# EAGLE design Binary Clock (no alarm) (EAGLE 5.06)
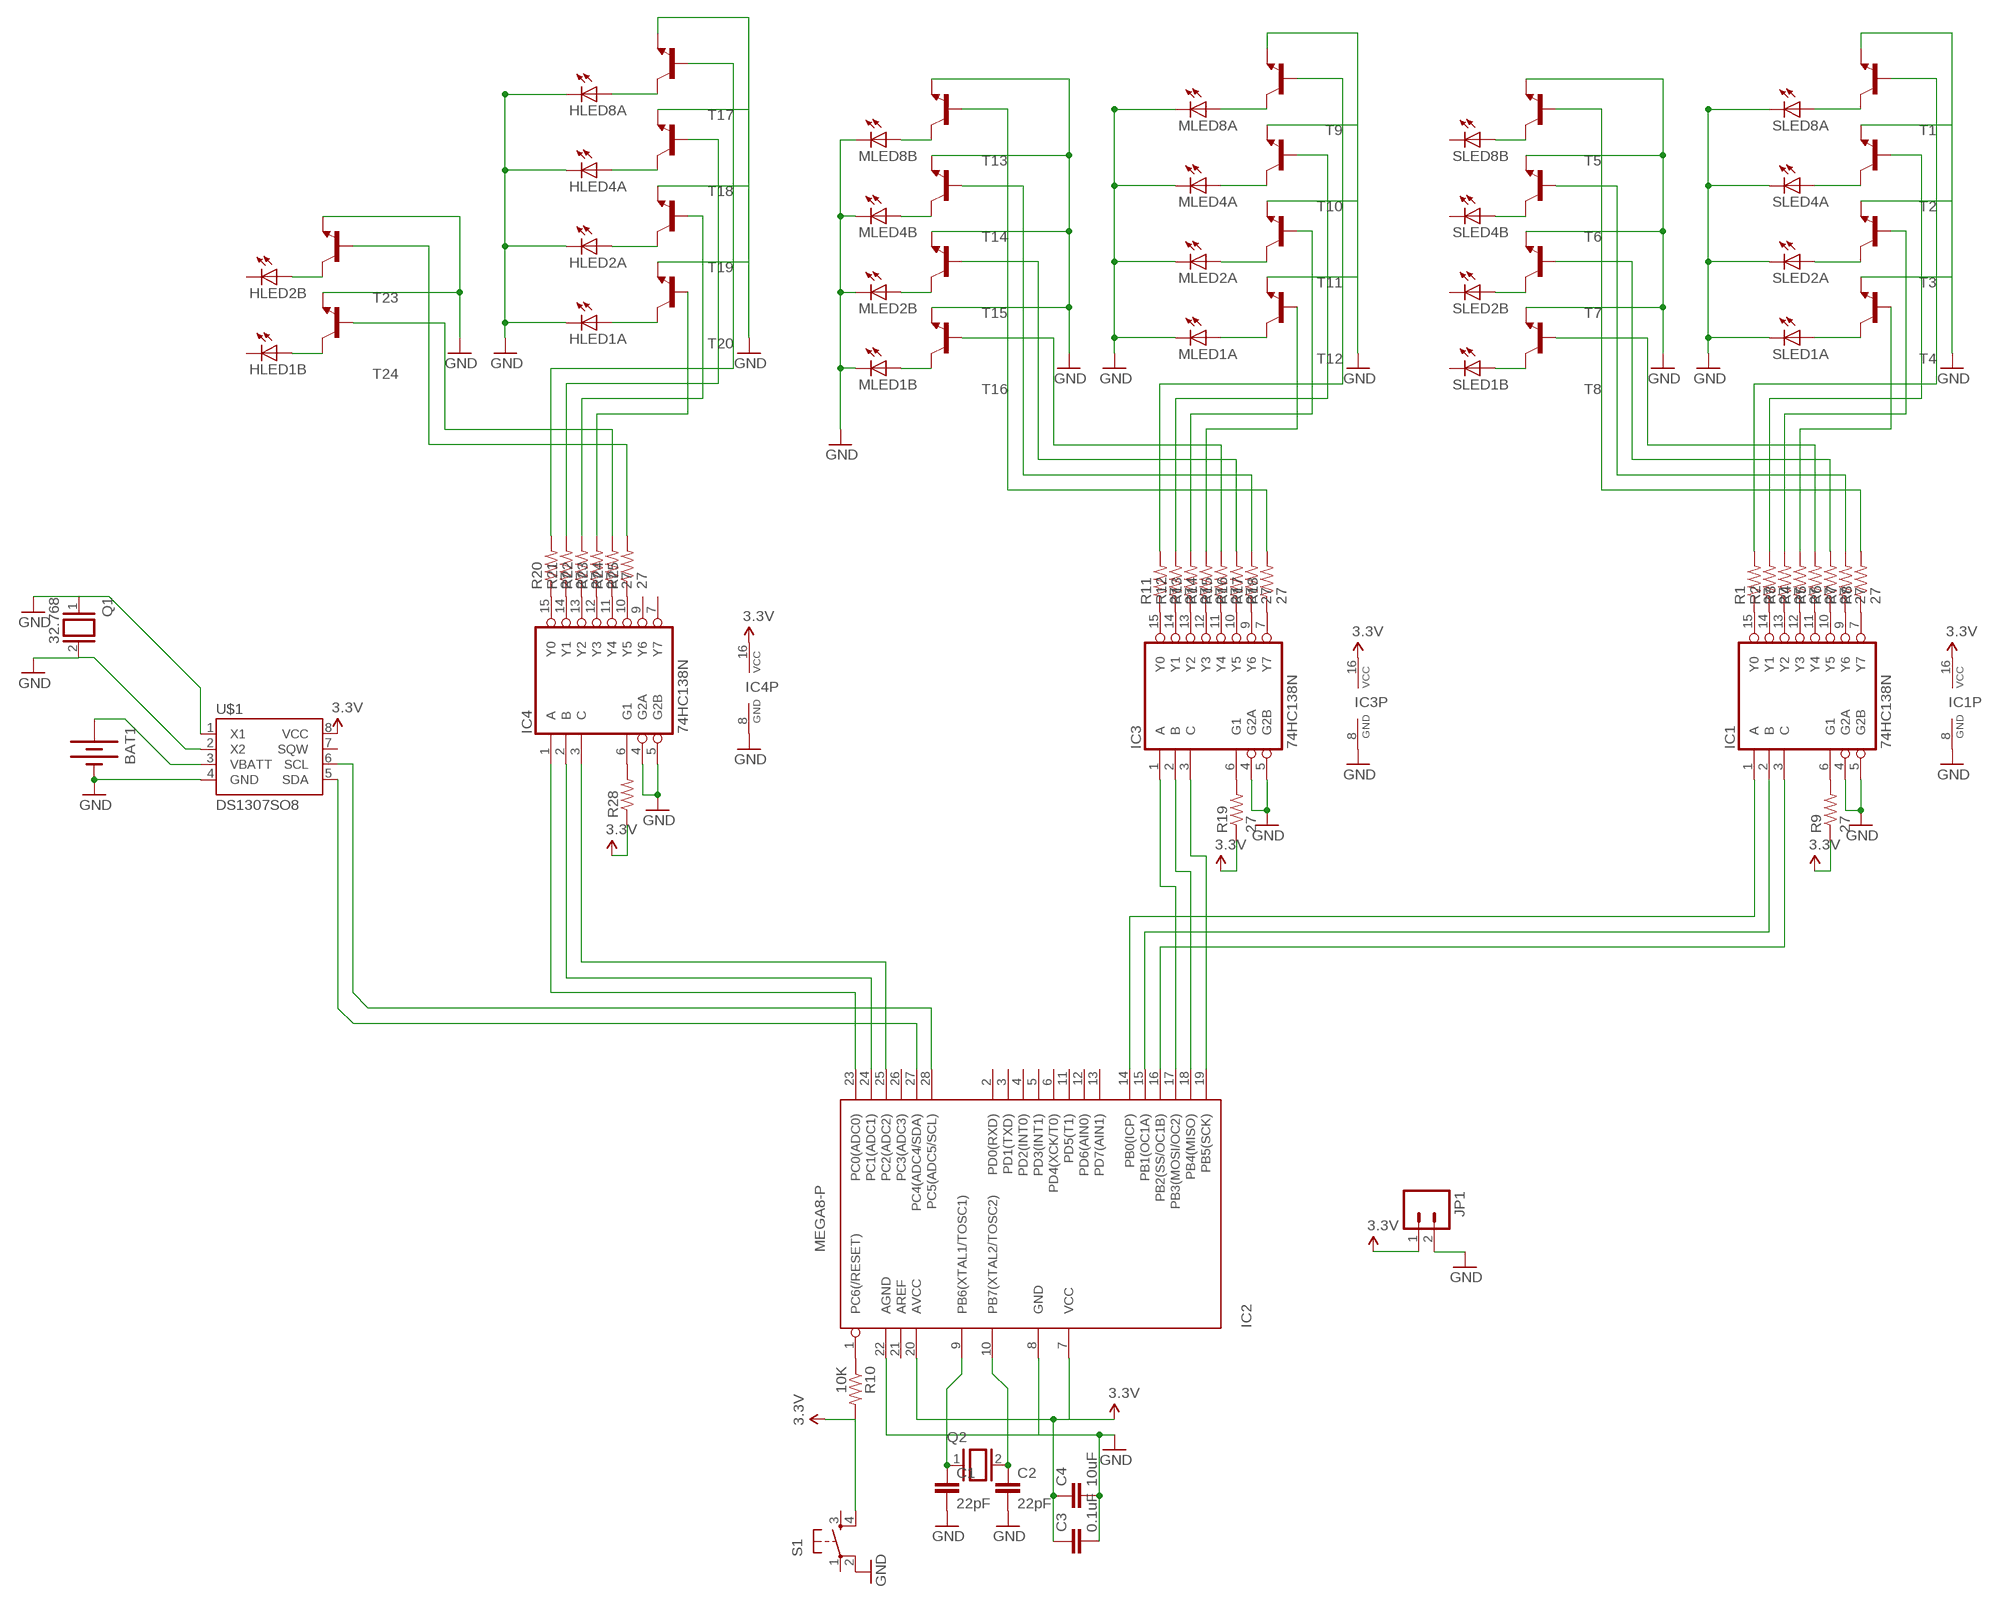
[diagram p0: schematic, sheet 1]

## Parts
BAT1  BATTERY12PTH  [BATTCON_12MM_PTH]
C1  22pF  CAPPTH1  [CAP-PTH-5MM]
C2  22pF  CAPPTH1  [CAP-PTH-5MM]
C3  0.1uF  CAPPTH1  [CAP-PTH-5MM]
C4  10uF  CAPPTH1  [CAP-PTH-5MM]
HLED1A  LED5MM  [LED5MM]
HLED1B  LED5MM  [LED5MM]
HLED2A  LED5MM  [LED5MM]
HLED2B  LED5MM  [LED5MM]
HLED4A  LED5MM  [LED5MM]
HLED8A  LED5MM  [LED5MM]
IC1  74HC138N  [DIL16]
IC2  MEGA8-P  [DIL28-3]
IC3  74HC138N  [DIL16]
IC4  74HC138N  [DIL16]
JP1  M02LOCK  [1X02_LOCK]
MLED1A  LED5MM  [LED5MM]
MLED1B  LED5MM  [LED5MM]
MLED2A  LED5MM  [LED5MM]
MLED2B  LED5MM  [LED5MM]
MLED4A  LED5MM  [LED5MM]
MLED4B  LED5MM  [LED5MM]
MLED8A  LED5MM  [LED5MM]
MLED8B  LED5MM  [LED5MM]
Q1  32.768  XTAL/S  [QS]
Q2  XTAL/S  [QS]
R1  27  RESISTORPTH1  [AXIAL-0.3]
R2  27  RESISTORPTH1  [AXIAL-0.3]
R3  27  RESISTORPTH1  [AXIAL-0.3]
R4  27  RESISTORPTH1  [AXIAL-0.3]
R5  27  RESISTORPTH1  [AXIAL-0.3]
R6  27  RESISTORPTH1  [AXIAL-0.3]
R7  27  RESISTORPTH1  [AXIAL-0.3]
R8  27  RESISTORPTH1  [AXIAL-0.3]
R9  27  RESISTORPTH1  [AXIAL-0.3]
R10  10K  RESISTORPTH1  [AXIAL-0.3]
R11  27  RESISTORPTH1  [AXIAL-0.3]
R12  27  RESISTORPTH1  [AXIAL-0.3]
R13  27  RESISTORPTH1  [AXIAL-0.3]
R14  27  RESISTORPTH1  [AXIAL-0.3]
R15  27  RESISTORPTH1  [AXIAL-0.3]
R16  27  RESISTORPTH1  [AXIAL-0.3]
R17  27  RESISTORPTH1  [AXIAL-0.3]
R18  27  RESISTORPTH1  [AXIAL-0.3]
R19  27  RESISTORPTH1  [AXIAL-0.3]
R20  27  RESISTORPTH1  [AXIAL-0.3]
R21  27  RESISTORPTH1  [AXIAL-0.3]
R22  27  RESISTORPTH1  [AXIAL-0.3]
R23  27  RESISTORPTH1  [AXIAL-0.3]
R24  27  RESISTORPTH1  [AXIAL-0.3]
R25  27  RESISTORPTH1  [AXIAL-0.3]
R28  RESISTORPTH1  [AXIAL-0.3]
S1  TAC_SWITCHPTH  [TACTILE-PTH]
SLED1A  LED5MM  [LED5MM]
SLED1B  LED5MM  [LED5MM]
SLED2A  LED5MM  [LED5MM]
SLED2B  LED5MM  [LED5MM]
SLED4A  LED5MM  [LED5MM]
SLED4B  LED5MM  [LED5MM]
SLED8A  LED5MM  [LED5MM]
SLED8B  LED5MM  [LED5MM]
T1  -NPN-TO92  [TO92]
T2  -NPN-TO92  [TO92]
T3  -NPN-TO92  [TO92]
T4  -NPN-TO92  [TO92]
T5  -NPN-TO92  [TO92]
T6  -NPN-TO92  [TO92]
T7  -NPN-TO92  [TO92]
T8  -NPN-TO92  [TO92]
T9  -NPN-TO92  [TO92]
T10  -NPN-TO92  [TO92]
T11  -NPN-TO92  [TO92]
T12  -NPN-TO92  [TO92]
T13  -NPN-TO92  [TO92]
T14  -NPN-TO92  [TO92]
T15  -NPN-TO92  [TO92]
T16  -NPN-TO92  [TO92]
T17  -NPN-TO92  [TO92]
T18  -NPN-TO92  [TO92]
T19  -NPN-TO92  [TO92]
T20  -NPN-TO92  [TO92]
T23  -NPN-TO92  [TO92]
T24  -NPN-TO92  [TO92]
U$1  DS1307SO8  [SO08]

## Nets
3.3V: C3.1 C4.1 IC1.16(VCC) IC2.7(VCC) IC2.20(AVCC) IC3.16(VCC) IC4.16(VCC) JP1.1 R9.P$1 R10.P$2 R19.P$1 R28.P$1 S1.4 U$1.8(VCC)
GND: BAT1.GND(-) C1.2 C2.2 C3.2 C4.2 HLED1A.K(C) HLED2A.K(C) HLED4A.K(C) HLED8A.K(C) IC1.4(G2A) IC1.5(G2B) IC1.8(GND) IC2.8(GND) IC2.22(AGND) IC3.4(G2A) IC3.5(G2B) IC3.8(GND) IC4.4(G2A) IC4.5(G2B) IC4.8(GND) JP1.2 MLED1A.K(C) MLED1B.K(C) MLED2A.K(C) MLED2B.K(C) MLED4A.K(C) MLED4B.K(C) MLED8A.K(C) MLED8B.K(C) Q1.1 Q1.2 S1.2 SLED1A.K(C) SLED2A.K(C) SLED4A.K(C) SLED8A.K(C) T1.1(E) T2.1(E) T3.1(E) T4.1(E) T5.1(E) T6.1(E) T7.1(E) T8.1(E) T9.1(E) T10.1(E) T11.1(E) T12.1(E) T13.1(E) T14.1(E) T15.1(E) T16.1(E) T17.1(E) T18.1(E) T19.1(E) T20.1(E) T23.1(E) T24.1(E) U$1.1(X1) U$1.2(X2) U$1.4(GND)
N$1: IC1.15(Y0) R1.P$1
N$2: IC1.14(Y1) R2.P$1
N$3: IC1.13(Y2) R3.P$1
N$4: IC1.12(Y3) R4.P$1
N$5: IC1.11(Y4) R5.P$1
N$6: IC1.10(Y5) R6.P$1
N$7: IC1.9(Y6) R7.P$1
N$8: IC1.7(Y7) R8.P$1
N$9: SLED1A.A T4.3(C)
N$10: SLED2A.A T3.3(C)
N$11: SLED4A.A T2.3(C)
N$12: SLED8A.A T1.3(C)
N$13: R1.P$2 T1.2(B)
N$14: R2.P$2 T2.2(B)
N$15: R3.P$2 T3.2(B)
N$16: R4.P$2 T4.2(B)
N$17: IC1.6(G1) R9.P$2
N$18: SLED8B.A T5.3(C)
N$19: SLED4B.A T6.3(C)
N$20: SLED2B.A T7.3(C)
N$21: SLED1B.A T8.3(C)
N$22: R5.P$2 T8.2(B)
N$23: R6.P$2 T7.2(B)
N$24: R7.P$2 T6.2(B)
N$25: R8.P$2 T5.2(B)
N$26: C1.1 IC2.9(PB6(XTAL1/TOSC1)) Q2.1
N$27: IC2.1(PC6(/RESET)) R10.P$1
N$28: C2.1 IC2.10(PB7(XTAL2/TOSC2)) Q2.2
N$29: IC3.15(Y0) R11.P$1
N$30: IC3.14(Y1) R12.P$1
N$31: IC3.13(Y2) R13.P$1
N$32: IC3.12(Y3) R14.P$1
N$33: IC3.11(Y4) R15.P$1
N$34: IC3.10(Y5) R16.P$1
N$35: IC3.9(Y6) R17.P$1
N$36: IC3.7(Y7) R18.P$1
N$37: MLED1A.A T12.3(C)
N$38: MLED2A.A T11.3(C)
N$39: MLED4A.A T10.3(C)
N$40: MLED8A.A T9.3(C)
N$41: R11.P$2 T9.2(B)
N$42: R12.P$2 T10.2(B)
N$43: R13.P$2 T11.2(B)
N$44: R14.P$2 T12.2(B)
N$45: MLED8B.A T13.3(C)
N$46: MLED4B.A T14.3(C)
N$47: MLED2B.A T15.3(C)
N$48: MLED1B.A T16.3(C)
N$49: R15.P$2 T16.2(B)
N$50: R16.P$2 T15.2(B)
N$51: R17.P$2 T14.2(B)
N$52: R18.P$2 T13.2(B)
N$53: IC3.6(G1) R19.P$2
N$54: IC4.15(Y0) R20.P$1
N$55: IC4.14(Y1) R21.P$1
N$56: IC4.13(Y2) R22.P$1
N$57: IC4.12(Y3) R23.P$1
N$58: IC4.11(Y4) R24.P$1
N$59: IC4.10(Y5) R25.P$1
N$62: HLED1A.A T20.3(C)
N$63: HLED2A.A T19.3(C)
N$64: HLED4A.A T18.3(C)
N$65: HLED8A.A T17.3(C)
N$66: R20.P$2 T17.2(B)
N$67: R21.P$2 T18.2(B)
N$68: R22.P$2 T19.2(B)
N$69: R23.P$2 T20.2(B)
N$72: HLED2B.A T23.3(C)
N$73: HLED1B.A T24.3(C)
N$74: R24.P$2 T24.2(B)
N$75: R25.P$2 T23.2(B)
N$78: IC4.6(G1) R28.P$2
N$79: BAT1.VCC@1(+) U$1.3(VBATT)
N$80: IC2.27(PC4(ADC4/SDA)) U$1.5(SDA)
N$81: IC2.28(PC5(ADC5/SCL)) U$1.6(SCL)
N$82: IC2.17(PB3(MOSI/OC2)) IC3.1(A)
N$83: IC2.18(PB4(MISO)) IC3.2(B)
N$84: IC2.19(PB5(SCK)) IC3.3(C)
N$85: IC1.1(A) IC2.14(PB0(ICP))
N$86: IC1.2(B) IC2.15(PB1(OC1A))
N$87: IC1.3(C) IC2.16(PB2(SS/OC1B))
N$88: IC2.23(PC0(ADC0)) IC4.1(A)
N$89: IC2.24(PC1(ADC1)) IC4.2(B)
N$90: IC2.25(PC2(ADC2)) IC4.3(C)
Unconnected: HLED1B.K(C) HLED2B.K(C) IC2.2(PD0(RXD)) IC2.3(PD1(TXD)) IC2.4(PD2(INT0)) IC2.5(PD3(INT1)) IC2.6(PD4(XCK/T0)) IC2.11(PD5(T1)) IC2.12(PD6(AIN0)) IC2.13(PD7(AIN1)) IC2.21(AREF) IC2.26(PC3(ADC3)) IC4.7(Y7) IC4.9(Y6) S1.1 S1.3 SLED1B.K(C) SLED2B.K(C) SLED4B.K(C) SLED8B.K(C) U$1.7(SQW)

## Library data of the parts
BAT1 = SparkFun:BATTERY: Battery Holders Various common sizes : AA, AAA, 20mm coin cell and 12mm coin cell.
C1-C4 = SparkFun:CAP: Capacitor Standard 0603 ceramic capacitor, and 0.1" leaded capacitor.
HLED1A HLED1B HLED2A HLED2B HLED4A HLED8A MLED1A MLED1B MLED2A MLED2B MLED4A MLED4B MLED8A MLED8B SLED1A SLED1B SLED2A SLED2B SLED4A SLED4B SLED8A SLED8B = led:LED: LED OSRAM: - CHIPLED LG R971, LG N971, LY N971, LG Q971, LY Q971, LO R971, LY R971 LH N974, LH R974 LS Q976, LO Q976, LY Q976 LO Q996 - Hyper CHIPLED LW Q18S LB Q993, LB Q99A, LB R99A - SideLED LS A670, LO A670, LY A670, LG A670, LP A670 LB A673, LV A673, LT A673, LW A673 LH A674 LY A675 LS A676, LA A676, LO A676, LY A676, LW A676 LS A679, LY A679, LG A679 - Hyper Micro SIDELED® LS Y876, LA Y876, LO Y876, LY Y876 LT Y87S - SmartLED LW L88C, LW L88S LB L89C, LB L89S, LG L890 LS L89K, LO L89K, LY L89K LS L896, LA L896, LO L896, LY L896 - TOPLED LS T670, LO T670, LY T670, LG T670, LP T670 LSG T670, LSP T670, LSY T670, LOP T670, LYG T670 LG T671, LOG T671, LSG T671 LB T673, LV T673, LT T673, LW T673 LH T674 LS T676, LA T676, LO T676, LY T676, LB T676, LH T676, LSB T676, LW T676 LB T67C, LV T67C, LT T67C, LS T67K, LO T67K, LY T67K, LW E67C LS E67B, LA E67B, LO E67B, LY E67B, LB E67C, LV E67C, LT E67C LW T67C LS T679, LY T679, LG T679 LS T770, LO T770, LY T770, LG T770, LP T770 LB T773, LV T773, LT T773, LW T773 LH T774 LS E675, LA E675, LY E675, LS T675 LS T776, LA T776, LO T776, LY T776, LB T776 LHGB T686 LT T68C, LB T68C - Hyper Mini TOPLED® LB M676 - Mini TOPLED Santana® LG M470 LS M47K, LO M47K, LY M47K Source: http://www.osram.convergy.de LUXEON: - LUMILED® LXK2-PW12-R00, LXK2-PW12-S00, LXK2-PW14-U00, LXK2-PW14-V00 LXK2-PM12-R00, LXK2-PM12-S00, LXK2-PM14-U00 LXK2-PE12-Q00, LXK2-PE12-R00, LXK2-PE12-S00, LXK2-PE14-T00, LXK2-PE14-U00 LXK2-PB12-K00, LXK2-PB12-L00, LXK2-PB12-M00, LXK2-PB14-N00, LXK2-PB14-P00, LXK2-PB14-Q00 LXK2-PR12-L00, LXK2-PR12-M00, LXK2-PR14-Q00, LXK2-PR14-R00 LXK2-PD12-Q00, LXK2-PD12-R00, LXK2-PD12-S00 LXK2-PH12-R00, LXK2-PH12-S00 LXK2-PL12-P00, LXK2-PL12-Q00, LXK2-PL12-R00 Source: www.luxeon.com KINGBRIGHT: KA-3528ASYC Source: www.kingbright.com
IC1 IC3 IC4 = 74xx-eu:74*138: 3-line to 8-line DECODER/DEMULTIPLEXER
IC2 = avr-6:MEGA8-P: MICROCONTROLLER 8 Kbytes FLASH 1 kbytes SRAM 512 bytes EEPROM USART 4-channel 10 bit ADC 2-channel 8 bit ADC
JP1 = SparkFun:M02: Header 2 Standard 2-pin 0.1" header. Use with straight break away headers (SKU : PRT-00116), right angle break away headers (PRT-00553), swiss pins (PRT-00743), machine pins (PRT-00117), and female headers (PRT-00115). Molex polarized connector foot print use with SKU : PRT-08233 with associated crimp pins and housings.
Q1 Q2 = special:XTAL/S: CRYSTAL
R1-R25 R28 = SparkFun:RESISTOR: Resistor Basic schematic elements and footprints for 0603, 1206, and PTH 1/10th watt (small) resistors.
S1 = SparkFun:TAC_SWITCH: Momentary Switch Button commonly used for reset or general input. Spark Fun Electronics SKU : COM-00097
T1-T20 T23 T24 = transistor-neu-to92:*-NPN-: NPN Transistror
U$1 = SparkFun:DS1307

## Board
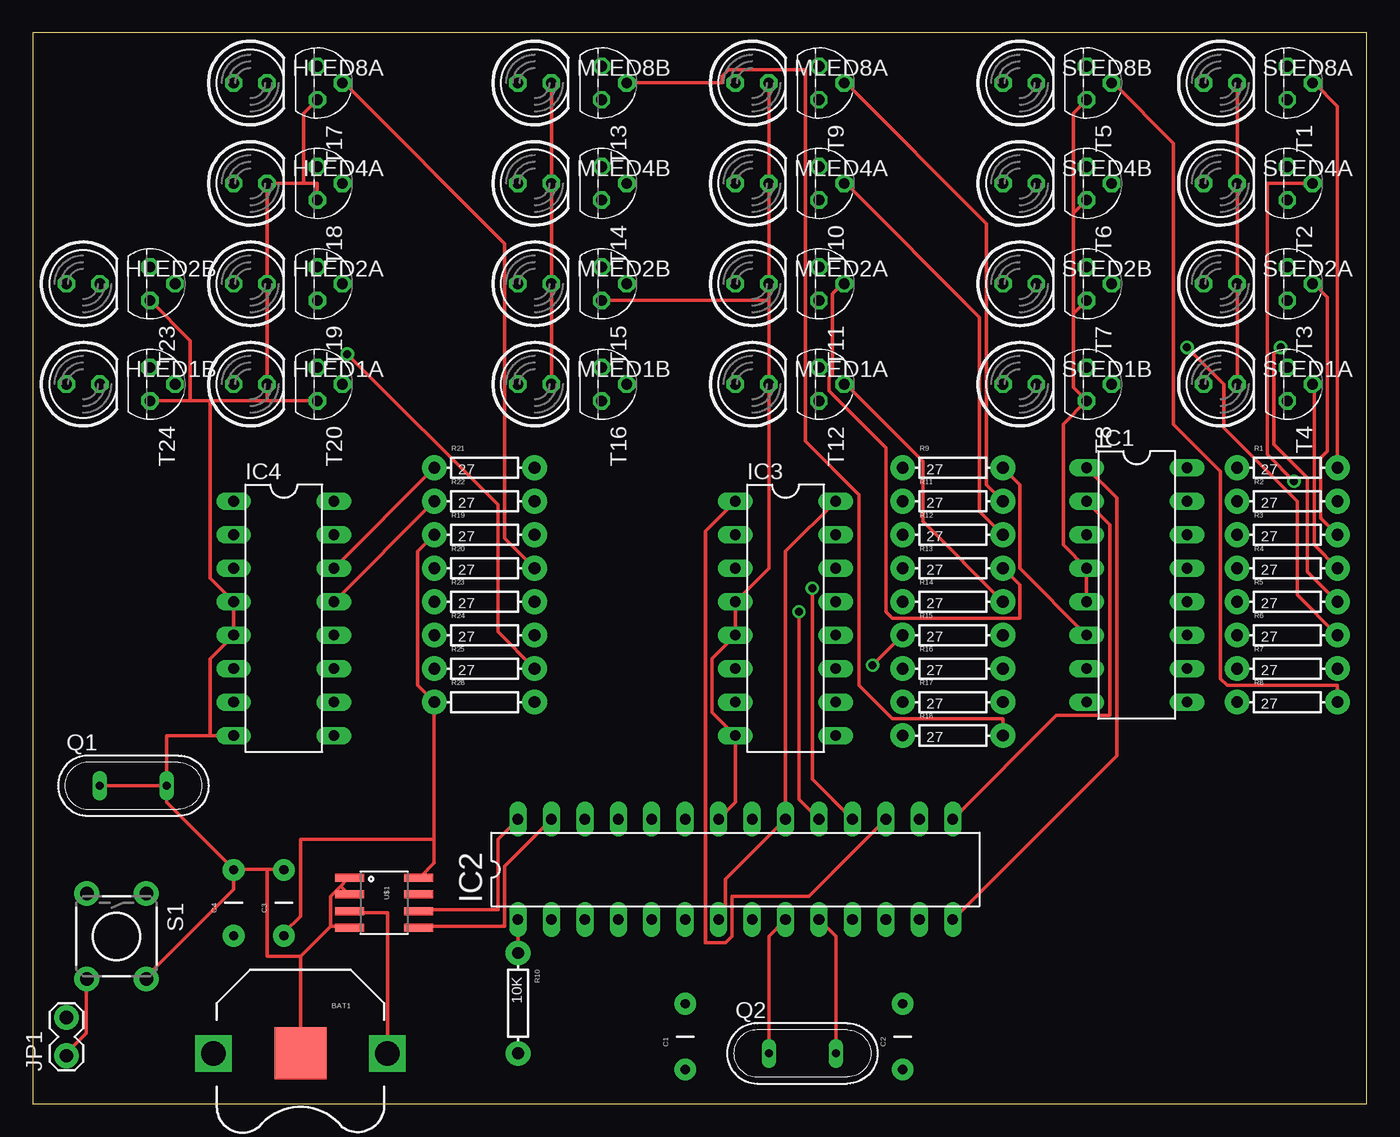
[diagram p1: board, top side]
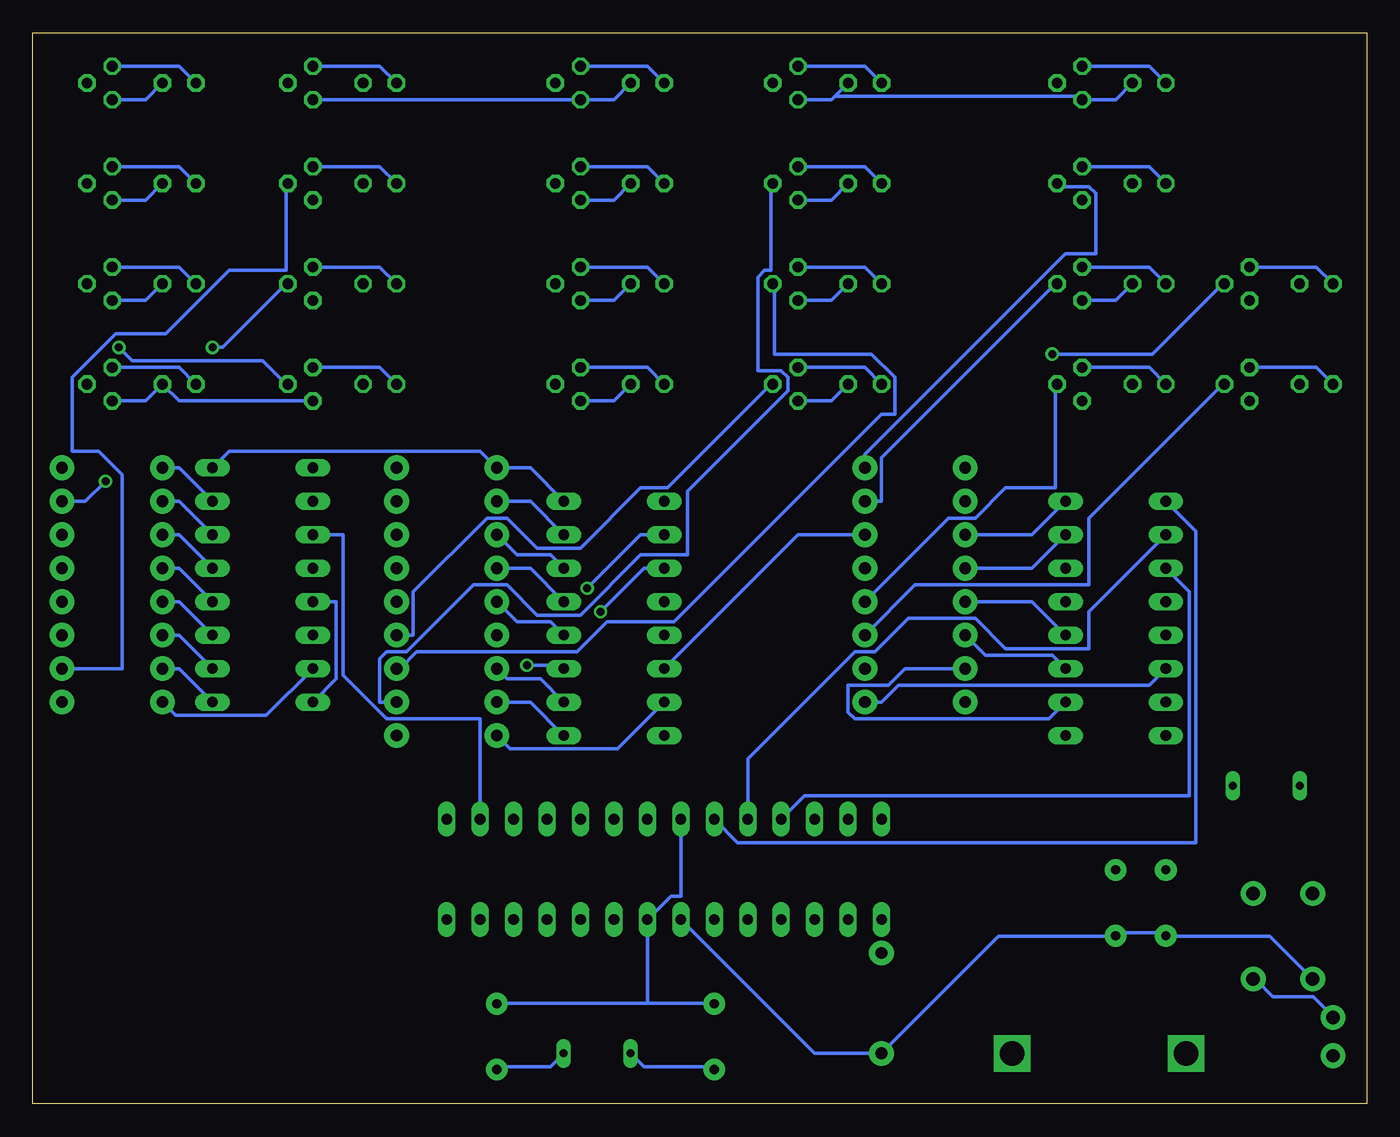
[diagram p2: board, bottom side, seen from below]

Size 101.27 x 81.27 mm. Coordinates in mm from the lower left corner, seen from the top.
Outline: 0,0 101.27,0 101.27,81.27 0,81.27 0,0
Copper layers (1*16): Top 0.035mm / dielectric 1.5mm / Bottom 0.035mm
Design rules "default": minimum track width 10mil, minimum drill 24mil, track to track 8mil, track to pad 8mil, pad to pad 8mil, via to via 8mil, smd to smd 8mil, copper to edge 40mil, drill to drill 8mil, minimum pad ring 10mil, minimum via ring 8mil, stop-mask expansion 4mil, vias tented up to drill 0mil, thermal gap 10mil

### Footprints (pad centres in the part's own frame; a part is rotated, then mirrored left to right if it is on the bottom)
BATTCON_12MM_PTH = smd 3.962 x 3.962: GND 0,0 | drill 1.854 square: VCC@1 -6.604,0; VCC@2 6.604,0
CAP-PTH-5MM = drill 0.7 pad 1.651 round: 1 -2.5,0; 2 2.5,0
LED5MM = drill 0.813 octagon: A -1.27,0; K 1.27,0
DIL16 = drill 0.813 long: 1 -8.89,-3.81; 2 -6.35,-3.81; 3 -3.81,-3.81; 4 -1.27,-3.81; 5 1.27,-3.81; 6 3.81,-3.81; 7 6.35,-3.81; 8 8.89,-3.81; 9 8.89,3.81; 10 6.35,3.81; 11 3.81,3.81; 12 1.27,3.81; 13 -1.27,3.81; 14 -3.81,3.81; 15 -6.35,3.81; 16 -8.89,3.81
DIL28-3 = drill 0.813 long: 1 -16.51,-3.81; 2 -13.97,-3.81; 3 -11.43,-3.81; 4 -8.89,-3.81; 5 -6.35,-3.81; 6 -3.81,-3.81; 7 -1.27,-3.81; 8 1.27,-3.81; 9 3.81,-3.81; 10 6.35,-3.81; 11 8.89,-3.81; 12 11.43,-3.81; 13 13.97,-3.81; 14 16.51,-3.81; 15 16.51,3.81; 16 13.97,3.81; 17 11.43,3.81; 18 8.89,3.81; 19 6.35,3.81; 20 3.81,3.81; 21 1.27,3.81; 22 -1.27,3.81; 23 -3.81,3.81; 24 -6.35,3.81; 25 -8.89,3.81; 26 -11.43,3.81; 27 -13.97,3.81; 28 -16.51,3.81
1X02_LOCK = drill 1.016 pad 1.88 round: 1 -0.178,0; 2 2.718,0
QS = drill 0.61 long: 1 -2.54,0; 2 2.54,0
AXIAL-0.3 = drill 0.9 pad 1.88 round: P$1 -3.81,0; P$2 3.81,0
TACTILE-PTH = drill 1.016 pad 1.88 round: 1 -3.251,2.261; 2 3.251,2.261; 3 -3.251,-2.261; 4 3.251,-2.261
TO92 = drill 0.813 octagon: 1 1.27,0; 2 0,1.905; 3 -1.27,0
SO08 = smd 0.61 x 2.21: 1 -1.905,-2.616; 2 -0.635,-2.616; 3 0.635,-2.616; 4 1.905,-2.616; 5 1.905,2.616; 6 0.635,2.616; 7 -0.635,2.616; 8 -1.905,2.616

### Placement (x,y rotation side)
BAT1  20.32,3.81 180 top
C1  49.53,5.08 90 top
C2  66.04,5.08 90 top
C3  19.05,15.24 90 top
C4  15.24,15.24 90 top
HLED1A  16.51,54.61 0 top
HLED1B  3.81,54.61 0 top
HLED2A  16.51,62.23 0 top
HLED2B  3.81,62.23 0 top
HLED4A  16.51,69.85 0 top
HLED8A  16.51,77.47 0 top
IC1  83.82,39.37 270 top
IC2  53.34,17.78 0 top
IC3  57.15,36.83 270 top
IC4  19.05,36.83 270 top
JP1  2.54,3.81 90 top
MLED1A  54.61,54.61 0 top
MLED1B  38.1,54.61 0 top
MLED2A  54.61,62.23 0 top
MLED2B  38.1,62.23 0 top
MLED4A  54.61,69.85 0 top
MLED4B  38.1,69.85 0 top
MLED8A  54.61,77.47 0 top
MLED8B  38.1,77.47 0 top
Q1  7.62,24.13 0 top
Q2  58.42,3.81 0 top
R1  95.25,48.26 0 top
R2  95.25,45.72 0 top
R3  95.25,43.18 0 top
R4  95.25,40.64 0 top
R5  95.25,38.1 0 top
R6  95.25,35.56 0 top
R7  95.25,33.02 0 top
R8  95.25,30.48 0 top
R9  69.85,48.26 0 top
R10  36.83,7.62 270 top
R11  69.85,45.72 0 top
R12  69.85,43.18 0 top
R13  69.85,40.64 0 top
R14  69.85,38.1 0 top
R15  69.85,35.56 0 top
R16  69.85,33.02 0 top
R17  69.85,30.48 0 top
R18  69.85,27.94 0 top
R19  34.29,43.18 0 top
R20  34.29,40.64 0 top
R21  34.29,48.26 0 top
R22  34.29,45.72 0 top
R23  34.29,38.1 0 top
R24  34.29,35.56 0 top
R25  34.29,33.02 0 top
R28  34.29,30.48 0 top
S1  6.35,12.7 270 top
SLED1A  90.17,54.61 0 top
SLED1B  74.93,54.61 0 top
SLED2A  90.17,62.23 0 top
SLED2B  74.93,62.23 0 top
SLED4A  90.17,69.85 0 top
SLED4B  74.93,69.85 0 top
SLED8A  90.17,77.47 0 top
SLED8B  74.93,77.47 0 top
T1  95.25,77.47 270 top
T2  95.25,69.85 270 top
T3  95.25,62.23 270 top
T4  95.25,54.61 270 top
T5  80.01,77.47 270 top
T6  80.01,69.85 270 top
T7  80.01,62.23 270 top
T8  80.01,54.61 270 top
T9  59.69,77.47 270 top
T10  59.69,69.85 270 top
T11  59.69,62.23 270 top
T12  59.69,54.61 270 top
T13  43.18,77.47 270 top
T14  43.18,69.85 270 top
T15  43.18,62.23 270 top
T16  43.18,54.61 270 top
T17  21.59,77.47 270 top
T18  21.59,69.85 270 top
T19  21.59,62.23 270 top
T20  21.59,54.61 270 top
T23  8.89,62.23 270 top
T24  8.89,54.61 270 top
U$1  26.67,15.24 270 top

### Tracks (layer width: path | path; a pad name or v marks a point on that pad's centre or on a via)
3.3V
  Top 0.254: 30.48,20.07 R28.P$1 29.21,31.75 29.21,41.91 R19.P$1 | 30.48,20.07 30.48,18.29 29.46,17.27 U$1.8 | IC2.7 52.58,14.48 52.58,17.02 IC2.20 57.15,41.91 IC3.16 | JP1.1 2.54,3.81 4.06,5.33 4.06,9.4 S1.4 | 30.48,20.07 20.32,20.07 20.32,14.22 19.05,12.95 C3.1
  Bottom 0.254: IC4.16 25.4,43.18 R19.P$1 | IC3.16 63.5,48.26 R9.P$1 67.31,49.53 86.36,49.53 IC1.16 | S1.4 4.32,9.65 7.37,12.7 15.24,12.7 C4.1 15.24,12.95 19.05,12.95 C3.1 19.05,12.7 27.94,12.7 R10.P$2 41.91,3.81 IC2.7
GND
  Top 0.254: SLED1A.K SLED2A.K SLED4A.K SLED8A.K | IC1.5 IC1.4 78.23,42.42 78.23,51.56 T8.1 78.99,54.36 78.99,59.94 | 78.99,59.94 T7.1 | 78.99,67.56 T6.1 | 78.99,67.56 78.99,59.94 | T5.1 78.99,75.18 78.99,67.56 | 22.61,13.46 23.88,13.46 U$1.4 | 22.61,13.46 22.61,15.75 23.37,16.51 | 23.37,16.51 23.88,17.02 U$1.1 | 23.37,16.51 23.88,16 U$1.2 | 20.32,11.18 22.61,13.46 | 20.32,11.18 BAT1.GND | 17.78,17.78 19.05,17.78 C3.2 | 15.24,17.78 17.78,17.78 | Q1.2 Q1.1 | 13.46,27.94 10.16,27.94 Q1.2 | 13.46,27.94 IC4.8 | 13.46,27.94 13.46,33.78 IC4.5 IC4.4 13.46,39.88 13.46,53.34 | 15.24,17.78 10.16,22.86 Q1.2 | 15.24,17.78 C4.2 15.24,16.26 8.64,9.65 S1.2 | 20.32,11.18 17.78,11.18 17.78,17.78 | IC2.22 53.34,22.86 IC3.8 51.56,29.72 51.56,33.78 IC3.5 IC3.4 55.88,40.64 MLED1A.K 55.88,60.96 | 13.46,53.34 17.78,53.34 | 13.46,53.34 11.94,53.34 | 11.94,53.34 T24.1 | 17.78,53.34 HLED1A.K HLED2A.K HLED4A.K 20.57,69.85 | T23.1 11.94,57.91 11.94,53.34 | 17.78,53.34 T20.1 | 20.57,69.85 21.59,69.85 T18.1 | T17.1 20.57,75.18 20.57,69.85 | MLED1B.K MLED2B.K MLED4B.K MLED8B.K | 55.88,60.96 MLED2A.K MLED4A.K MLED8A.K | T15.1 55.88,60.96
  Bottom 0.254: T4.1 92.71,53.34 SLED1A.K 90.17,53.34 T8.1 | SLED2A.K 92.71,60.96 T3.1 | SLED4A.K 92.71,68.58 T2.1 | SLED8A.K 92.71,76.2 T1.1 | IC1.8 78.23,32.26 78.23,38.1 IC1.5 | JP1.2 2.54,6.6 4.06,8.13 7.11,8.13 8.38,9.4 S1.2 | 54.61,7.62 IC2.8 52.83,15.75 52.07,15.75 IC2.22 | 54.61,7.62 49.53,7.62 C1.2 | 54.61,7.62 66.04,7.62 C2.2 | HLED8A.K 19.05,76.2 T17.1 21.84,76.45 40.39,76.45 | HLED2A.K 19.05,60.96 T19.1 | MLED1B.K 40.64,53.34 T16.1 | MLED2B.K 40.64,60.96 T15.1 | MLED4B.K 40.64,68.58 T14.1 | 40.39,76.45 40.64,76.2 T13.1 | 40.39,76.45 MLED8B.K | MLED1A.K 57.15,53.34 T12.1 | MLED2A.K 57.15,60.96 T11.1 | MLED4A.K 57.15,68.58 T10.1 | MLED8A.K 57.15,76.2 T9.1 T5.1
N$1
  Bottom 0.254: IC1.15 90.17,48.26 R1.P$1
N$2
  Bottom 0.254: IC1.14 90.17,45.72 R2.P$1
N$3
  Bottom 0.254: IC1.13 90.17,43.18 R3.P$1
N$4
  Bottom 0.254: IC1.12 90.17,40.64 R4.P$1
N$5
  Bottom 0.254: IC1.11 90.17,38.1 R5.P$1
N$6
  Bottom 0.254: IC1.10 90.17,35.56 R6.P$1
N$7
  Bottom 0.254: IC1.9 90.17,33.02 R7.P$1
N$8
  Bottom 0.254: IC1.7 83.57,29.46 90.42,29.46 R8.P$1
N$9
  Bottom 0.254: SLED1A.A 90.17,55.88 T4.3
N$10
  Bottom 0.254: SLED2A.A 90.17,63.5 T3.3
N$11
  Bottom 0.254: SLED4A.A 90.17,71.12 T2.3
N$12
  Bottom 0.254: SLED8A.A 90.17,78.74 T1.3
N$13
  Top 0.254: R1.P$2 99.06,75.69 97.28,77.47 T1.2
N$14  (via drill 0.61)
  Top 0.254: v95.76,47.24 93.73,49.28 93.73,69.85 T2.2
  Bottom 0.254: v95.76,47.24 97.28,45.72 R2.P$2
N$15
  Top 0.254: R3.P$2 97.79,44.45 97.79,49.02 98.3,49.53 98.3,61.21 97.28,62.23 T3.2
N$16
  Top 0.254: R4.P$2 97.28,42.42 97.28,54.61 T4.2
N$17
  Top 0.254: IC1.6 74.93,40.64 74.93,46.99 R9.P$2
N$18
  Bottom 0.254: SLED8B.A 74.93,78.74 T5.3
N$19
  Bottom 0.254: SLED4B.A 74.93,71.12 T6.3
N$20
  Bottom 0.254: SLED2B.A 74.93,63.5 T7.3
N$21
  Bottom 0.254: SLED1B.A 74.93,55.88 T8.3
N$22  (via drill 0.61)
  Top 0.254: v94.74,57.4 94.23,56.9 94.23,50.04 96.77,47.5 96.77,40.39 R5.P$2
  Bottom 0.254: v94.74,57.4 93.73,56.39 83.82,56.39 82.04,54.61 T8.2
N$23  (via drill 0.61)
  Top 0.254: v87.63,57.4 90.42,54.61 90.42,51.31 96.01,45.72 96.01,38.61 R6.P$2
  Bottom 0.254: v87.63,57.4 86.87,57.4 82.04,62.23 T7.2
N$24
  Bottom 0.254: R7.P$2 94.49,33.02 94.49,47.75 96.27,49.53 98.3,49.53 98.3,55.12 95,58.42 91.19,58.42 86.36,63.25 82.04,63.25 82.04,69.85 T6.2
N$25
  Top 0.254: R8.P$2 99.06,31.75 90.68,31.75 90.17,32.26 90.17,48.01 86.61,51.56 86.61,72.9 82.04,77.47 T5.2
N$26
  Top 0.254: IC2.9 55.88,12.7 Q2.1
  Bottom 0.254: Q2.1 54.86,2.79 49.53,2.79 C1.1
N$27
  Top 0.254: R10.P$1 IC2.1
N$28
  Top 0.254: IC2.10 60.96,12.7 Q2.2
  Bottom 0.254: Q2.2 61.98,2.79 66.04,2.79 C2.1
N$29
  Bottom 0.254: IC3.15 63.5,45.72 R11.P$1
N$30
  Bottom 0.254: IC3.14 61.98,41.66 64.52,41.66 R12.P$1
N$31
  Bottom 0.254: IC3.13 63.5,40.64 R13.P$1
N$32
  Bottom 0.254: IC3.12 61.98,36.58 64.52,36.58 R14.P$1
N$33  (via drill 0.61)
  Top 0.254: v63.75,33.27 R15.P$1
  Bottom 0.254: IC3.11 61.21,33.27 v63.75,33.27
N$34
  Bottom 0.254: IC3.10 62.74,32.26 65.28,32.26 R16.P$1
N$35
  Bottom 0.254: IC3.9 63.5,30.48 R17.P$1
N$36
  Bottom 0.254: IC3.7 56.9,26.92 65.02,26.92 R18.P$1
N$37
  Bottom 0.254: MLED1A.A 54.61,55.88 T12.3
N$38
  Bottom 0.254: MLED2A.A 54.61,63.5 T11.3
N$39
  Bottom 0.254: MLED4A.A 54.61,71.12 T10.3
N$40
  Bottom 0.254: MLED8A.A 54.61,78.74 T9.3
N$41
  Top 0.254: R11.P$2 72.39,46.99 72.39,66.8 61.72,77.47 T9.2
N$42
  Top 0.254: R12.P$2 71.88,44.96 71.88,59.69 61.72,69.85 T10.2
N$43
  Top 0.254: R13.P$2 74.93,39.37 74.93,36.83 65.28,36.83 64.77,37.34 64.77,49.78 60.45,54.1 60.45,55.12 60.71,55.37 60.71,61.47 61.47,62.23 T11.2
N$44
  Top 0.254: R14.P$2 67.56,44.2 67.56,48.77 61.72,54.61 T12.2
N$45
  Bottom 0.254: MLED8B.A 38.1,78.74 T13.3
N$46
  Bottom 0.254: MLED4B.A 38.1,71.12 T14.3
N$47
  Bottom 0.254: MLED2B.A 38.1,63.5 T15.3
N$48
  Bottom 0.254: MLED1B.A 38.1,55.88 T16.3
N$49
  Bottom 0.254: R15.P$2 72.39,35.56 72.39,38.86 66.8,44.45 65.28,44.45 62.99,42.16 59.69,42.16 55.12,46.74 53.09,46.74 45.21,54.61 T16.2
N$50
  Bottom 0.254: R16.P$2 73.41,33.02 72.14,34.29 59.94,34.29 57.66,36.58 52.58,36.58 36.83,52.32 35.81,52.32 35.81,55.12 37.59,56.9 44.96,56.9 44.96,62.23 T15.2
N$51
  Bottom 0.254: R17.P$2 74.93,30.48 74.93,33.78 74.42,34.29 72.9,34.29 67.82,39.37 65.28,39.37 62.99,37.08 59.69,37.08 55.12,41.66 51.56,41.66 51.56,46.48 43.94,54.1 43.94,55.12 44.45,55.63 46.23,55.63 46.23,62.74 45.72,63.25 45.21,63.25 45.21,69.85 T14.2
N$52
  Top 0.254: R18.P$2 73.66,29.21 65.28,29.21 62.74,31.75 62.74,46.23 58.67,50.29 58.67,78.49 52.83,78.49 52.32,77.98 52.32,77.47 T13.2
N$53
  Bottom 0.254: IC3.6 43.18,43.18 R19.P$2
N$54
  Bottom 0.254: IC4.15 25.4,40.64 R20.P$1
N$55
  Top 0.254: IC4.14 R21.P$1
N$56
  Top 0.254: IC4.13 R22.P$1
N$57
  Bottom 0.254: IC4.12 25.4,38.1 R23.P$1
N$58
  Bottom 0.254: IC4.11 23.88,34.04 28.96,34.04 R24.P$1
N$59
  Bottom 0.254: IC4.10 24.13,29.21 38.86,29.21 39.37,29.72 39.37,31.75 36.32,31.75 35.05,33.02 R25.P$1
N$62
  Bottom 0.254: HLED1A.A 16.51,55.88 T20.3
N$63
  Bottom 0.254: HLED2A.A 16.51,63.5 T19.3
N$64
  Bottom 0.254: HLED4A.A 16.51,71.12 T18.3
N$65
  Bottom 0.254: HLED8A.A 16.51,78.74 T17.3
N$66
  Top 0.254: R20.P$2 35.81,42.93 35.81,65.28 23.62,77.47 T17.2
N$67
  Bottom 0.254: R21.P$2 38.1,49.28 22.86,64.52 20.57,64.52 20.57,69.09 21.08,69.6 23.11,69.6 23.37,69.85 T18.2
N$68
  Bottom 0.254: R22.P$2 36.83,45.72 36.83,49.02 23.62,62.23 T19.2
N$69
  Bottom 0.254: R23.P$2 31.75,44.45 29.72,44.45 27.43,46.74 23.62,46.74 23.62,54.61 T20.2
N$72
  Bottom 0.254: HLED2B.A 3.81,63.5 T23.3
N$73
  Bottom 0.254: HLED1B.A 3.81,55.88 T24.3
N$74
  Bottom 0.254: R24.P$2 34.29,39.37 21.08,39.37 21.08,44.45 10.92,54.61 T24.2
N$75  (via drill 0.61)
  Top 0.254: v23.88,56.9 35.31,45.47 35.31,35.81 R25.P$2
  Bottom 0.254: v23.88,56.9 16.26,56.9 10.92,62.23 T23.2
N$78
  Bottom 0.254: IC4.6 16.51,31.75 35.56,31.75 36.83,30.48 R28.P$2
N$79
  Top 0.254: BAT1.VCC@1 26.92,14.48 24.13,14.48 U$1.3
N$80
  Top 0.254: IC2.27 35.81,18.03 35.81,13.46 29.46,13.46 U$1.5
N$81
  Top 0.254: IC2.28 35.31,20.07 35.31,14.73 29.46,14.73 U$1.6
N$82
  Top 0.254: IC2.17 58.93,15.75 53.09,15.75 53.09,12.7 52.58,12.19 51.05,12.19 51.05,43.43 IC3.1
N$83  (via drill 0.61)
  Top 0.254: IC2.18 59.18,24.64 v59.18,39.12
  Bottom 0.254: v59.18,39.12 55.12,43.18 IC3.2
N$84  (via drill 0.61)
  Top 0.254: IC2.19 58.17,23.11 v58.17,37.34
  Bottom 0.254: v58.17,37.34 54.86,40.64 IC3.3
N$85
  Top 0.254: IC2.14 82.3,26.42 82.3,45.97 IC1.1
N$86
  Top 0.254: IC2.15 77.72,29.46 81.79,29.46 81.79,43.94 IC1.2
N$87
  Bottom 0.254: IC2.16 67.31,29.21 74.42,29.21 77.72,32.51 77.72,43.18 IC1.3
N$88
  Bottom 0.254: IC4.1 12.95,43.43 12.95,19.81 47.75,19.81 IC2.23
N$89
  Bottom 0.254: IC4.2 21.08,37.34 21.08,34.54 27.43,34.54 29.72,36.83 34.8,36.83 37.34,34.29 38.86,34.29 46.99,26.16 IC2.24
N$90
  Bottom 0.254: IC4.3 13.46,38.86 13.46,23.37 42.67,23.37 IC2.25